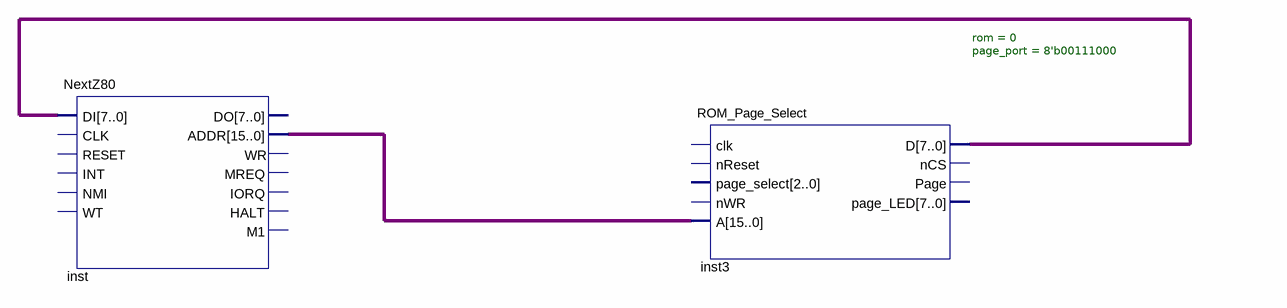
[diagram p0: schematic sheet]
// Quartus schematic RC2014_fpga.bdf as structural Verilog: 2 symbols, 0 pins
module RC2014_fpga (
);

  wire [7:0] inst3_d;
  wire [15:0] inst_addr;

  NextZ80 inst (.DI(inst3_d), .ADDR(inst_addr));  // open: CLK, RESET, INT, NMI, WT, DO, WR, MREQ, IORQ, HALT, M1
  ROM_Page_Select #(.rom(0), .page_port(8'b00111000)) inst3 (
    .A(inst_addr), .D(inst3_d));  // open: clk, nReset, page_select, nWR, nCS, Page, page_LED
endmodule
